# Altium schematic sheet Sheet4.SchDoc
size A
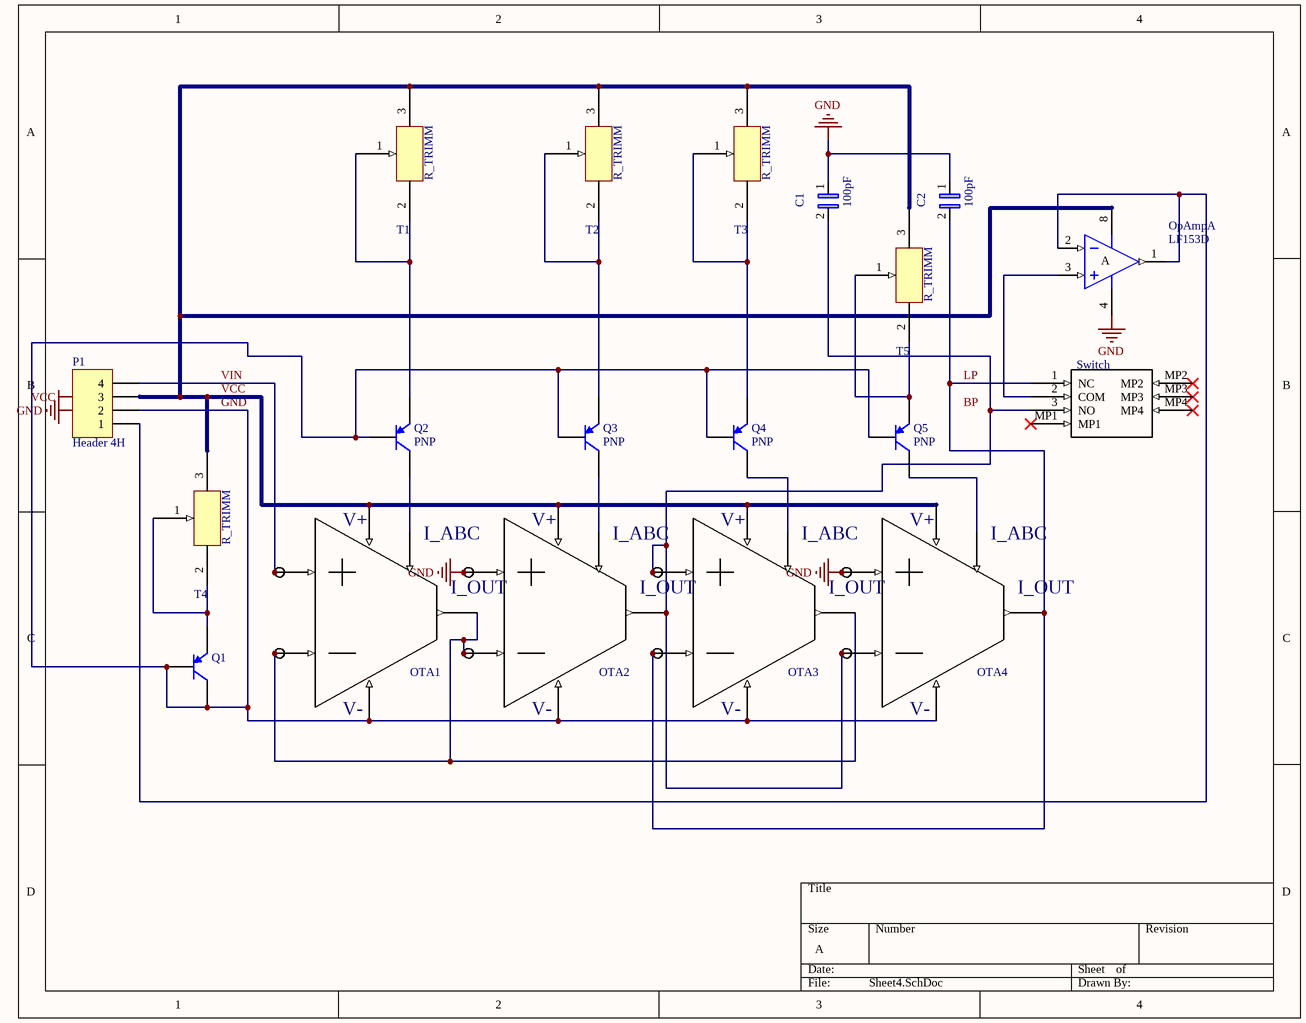
[diagram p0: Sheet4.SchDoc]

## Parts
C1  100pF  [_C*CAPC1005X55N_CC0402C100K5GACAUTO_CPrimary_C]
C2  100pF  [_C*CAPC1005X55N_CC0402C100K5GACAUTO_CPrimary_C]
OpAmp  LF153D  [SO8_N]  (part A of 2)
OTA1  (no value)
OTA2  (no value)
OTA3  (no value)
OTA4  (no value)
P1  Header 4H  [HDR1X4H]
Q1  (no value)  [TO-92A]
Q2  PNP  [SOT-23B]
Q3  PNP  [SOT-23B]
Q4  PNP  [SOT-23B]
Q5  PNP  [SOT-23B]
Switch  (no value)  [PCBComponent_1]
T1  (no value)  [PCBComponent_1]
T2  (no value)  [PCBComponent_1]
T3  (no value)  [PCBComponent_1]
T4  (no value)  [PCBComponent_1]
T5  (no value)  [PCBComponent_1]

## Nets
GND: C1.1 C2.1 OpAmp.4(V-) OTA1.?5 OTA2.?1 OTA2.?5 OTA3.?5 OTA4.?1 OTA4.?5 P1.2 Q1.2(B) Q1.3(C) Q2.2(B) Q3.2(B) Q4.2(B) Q5.2(B)
VCC: OpAmp.8(V+) OTA1.?4 OTA2.?4 OTA3.?4 OTA4.?4 P1.3 T1.3 T2.3 T3.3 T4.3 T5.3
LP: C2.2 OTA3.?2 OTA4.?3 Switch.1(NC)
VIN: OTA1.?1 P1.4
NetC1_2: C1.2 OTA2.?3 OTA3.?1 OTA4.?2 Switch.3(NO)
NetOpAmp_1: OpAmp.1(OUT) OpAmp.2(IN-) P1.1
NetOpAmp_3: OpAmp.3(IN+) Switch.2(COM)
NetOTA1_?2: OTA1.?2 OTA1.?3 OTA2.?2 OTA3.?3
NetOTA1_?6: OTA1.?6 Q2.1(C)
NetOTA2_?6: OTA2.?6 Q3.1(C)
NetOTA3_?6: OTA3.?6 Q4.1(C)
NetOTA4_?6: OTA4.?6 Q5.1(C)
NetQ1_1: Q1.1(E) T4.1
NetQ2_3: Q2.3(E) T1.1
NetQ3_3: Q3.3(E) T2.1
NetQ4_3: Q4.3(E) T3.1
NetQ5_3: Q5.3(E) T5.1

Not connected (* = marked no-connect by the designer): Switch MP1* MP2* MP3* MP4*; T1 2; T2 2; T3 2; T4 2; T5 2

## Notes on the sheet
- Labels drawn without touching a wire or pin: BP, GND, VCC
- (in symbol Component_1) R_TRIMM; V+; I_ABC; I_OUT; V-
- (in symbol LF153D, part A) A

## Library data of the parts
C1 C2 = C0402C100K5GACAUTO: CAPACITOR CERAMIC 10 PF 10% TOL 50V C0G 0402; MF: KEMET; SnapEDA_Link: https://www.snapeda.com/parts/C0402C100K5GACAUTO/KEMET/view-part/?ref=snap; Availability: Unavailable; MP: C0402C100K5GACAUTO; Package: 0402 KEMET; Price: None; Value: *
OpAmp = LF153D: Wide-Bandwidth Dual J-FET Operational Amplifier; Published: 24-Aug-2001; LatestRevisionDate: 13-Apr-2006; LatestRevisionNote: IPC-7351 Footprint Added.; DatasheetVersion: Jun-1998; PackageVersion: Dec-2002; PackageReference: SO8; Publisher: Altium Limited; PackageDescription: 8-Pin Small Outline Integrated Circuit 1.27 mm Pitch; Code_JEDEC: MS-012-AA; Code_IPC: SOIC127P600-8; ComponentLink1Description: Manufacturer Link; ComponentLink1URL: http://www.st.com/; ComponentLink2Description: Datasheet; ComponentLink2URL: http://www.st.com/stonline/products/literature/ds/2153/lf353.pdf
OTA1-OTA4 Switch T1-T5 = Component_1
P1 = Header 4H: Header, 4-Pin, Right Angle; LatestRevisionDate: 17-Jul-2002; LatestRevisionNote: Re-released for DXP Platform.; Publisher: Altium Limited
Q1 = 2N3906: PNP General Purpose Amplifier; Published: 8-Jun-2000; LatestRevisionDate: 15-Jan-2003; LatestRevisionNote: PCB Footprint 'BCY-W3/D4.7' replaced; DatasheetDocument: 1997; PackageDocument: Sep-1998; PackageReference: TO-92A; Publisher: Altium Limited; Code_JEDEC: TO-92A; ComponentLink1Description: Manufacturer Link; ComponentLink1URL: http://www.fairchildsemi.com/; ComponentLink2Description: Datasheet; ComponentLink2URL: http://www.fairchildsemi.com/ds/2N%2F2N3906.pdf
Q2-Q5 = PNP: PNP Bipolar Transistor; Published: 8-Jun-2000; LatestRevisionDate: 17-Jul-2002; LatestRevisionNote: Re-released for DXP Platform.; PackageReference: SOT-23B; Publisher: Altium Limited; Code_JEDEC: SOT-23